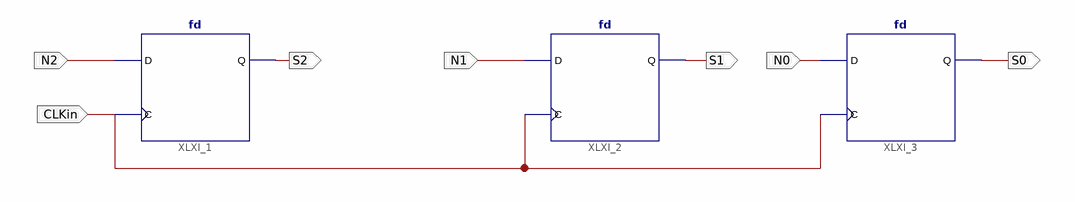
[diagram p0: schematic sheet 1]
// Xilinx ISE schematic REG3.sch (spartan6) as structural Verilog: 3 symbols, 7 ports
module REG3 (
  input  CLKin,
  input  N2,
  input  N1,
  input  N0,
  output S2,
  output S1,
  output S0
);

  fd XLXI_1 (.C(CLKin), .D(N2), .Q(S2));
  fd XLXI_2 (.C(CLKin), .D(N1), .Q(S1));
  fd XLXI_3 (.C(CLKin), .D(N0), .Q(S0));
endmodule
